# Altium schematic sheet Test.SchDoc
size 400 x 299 mm
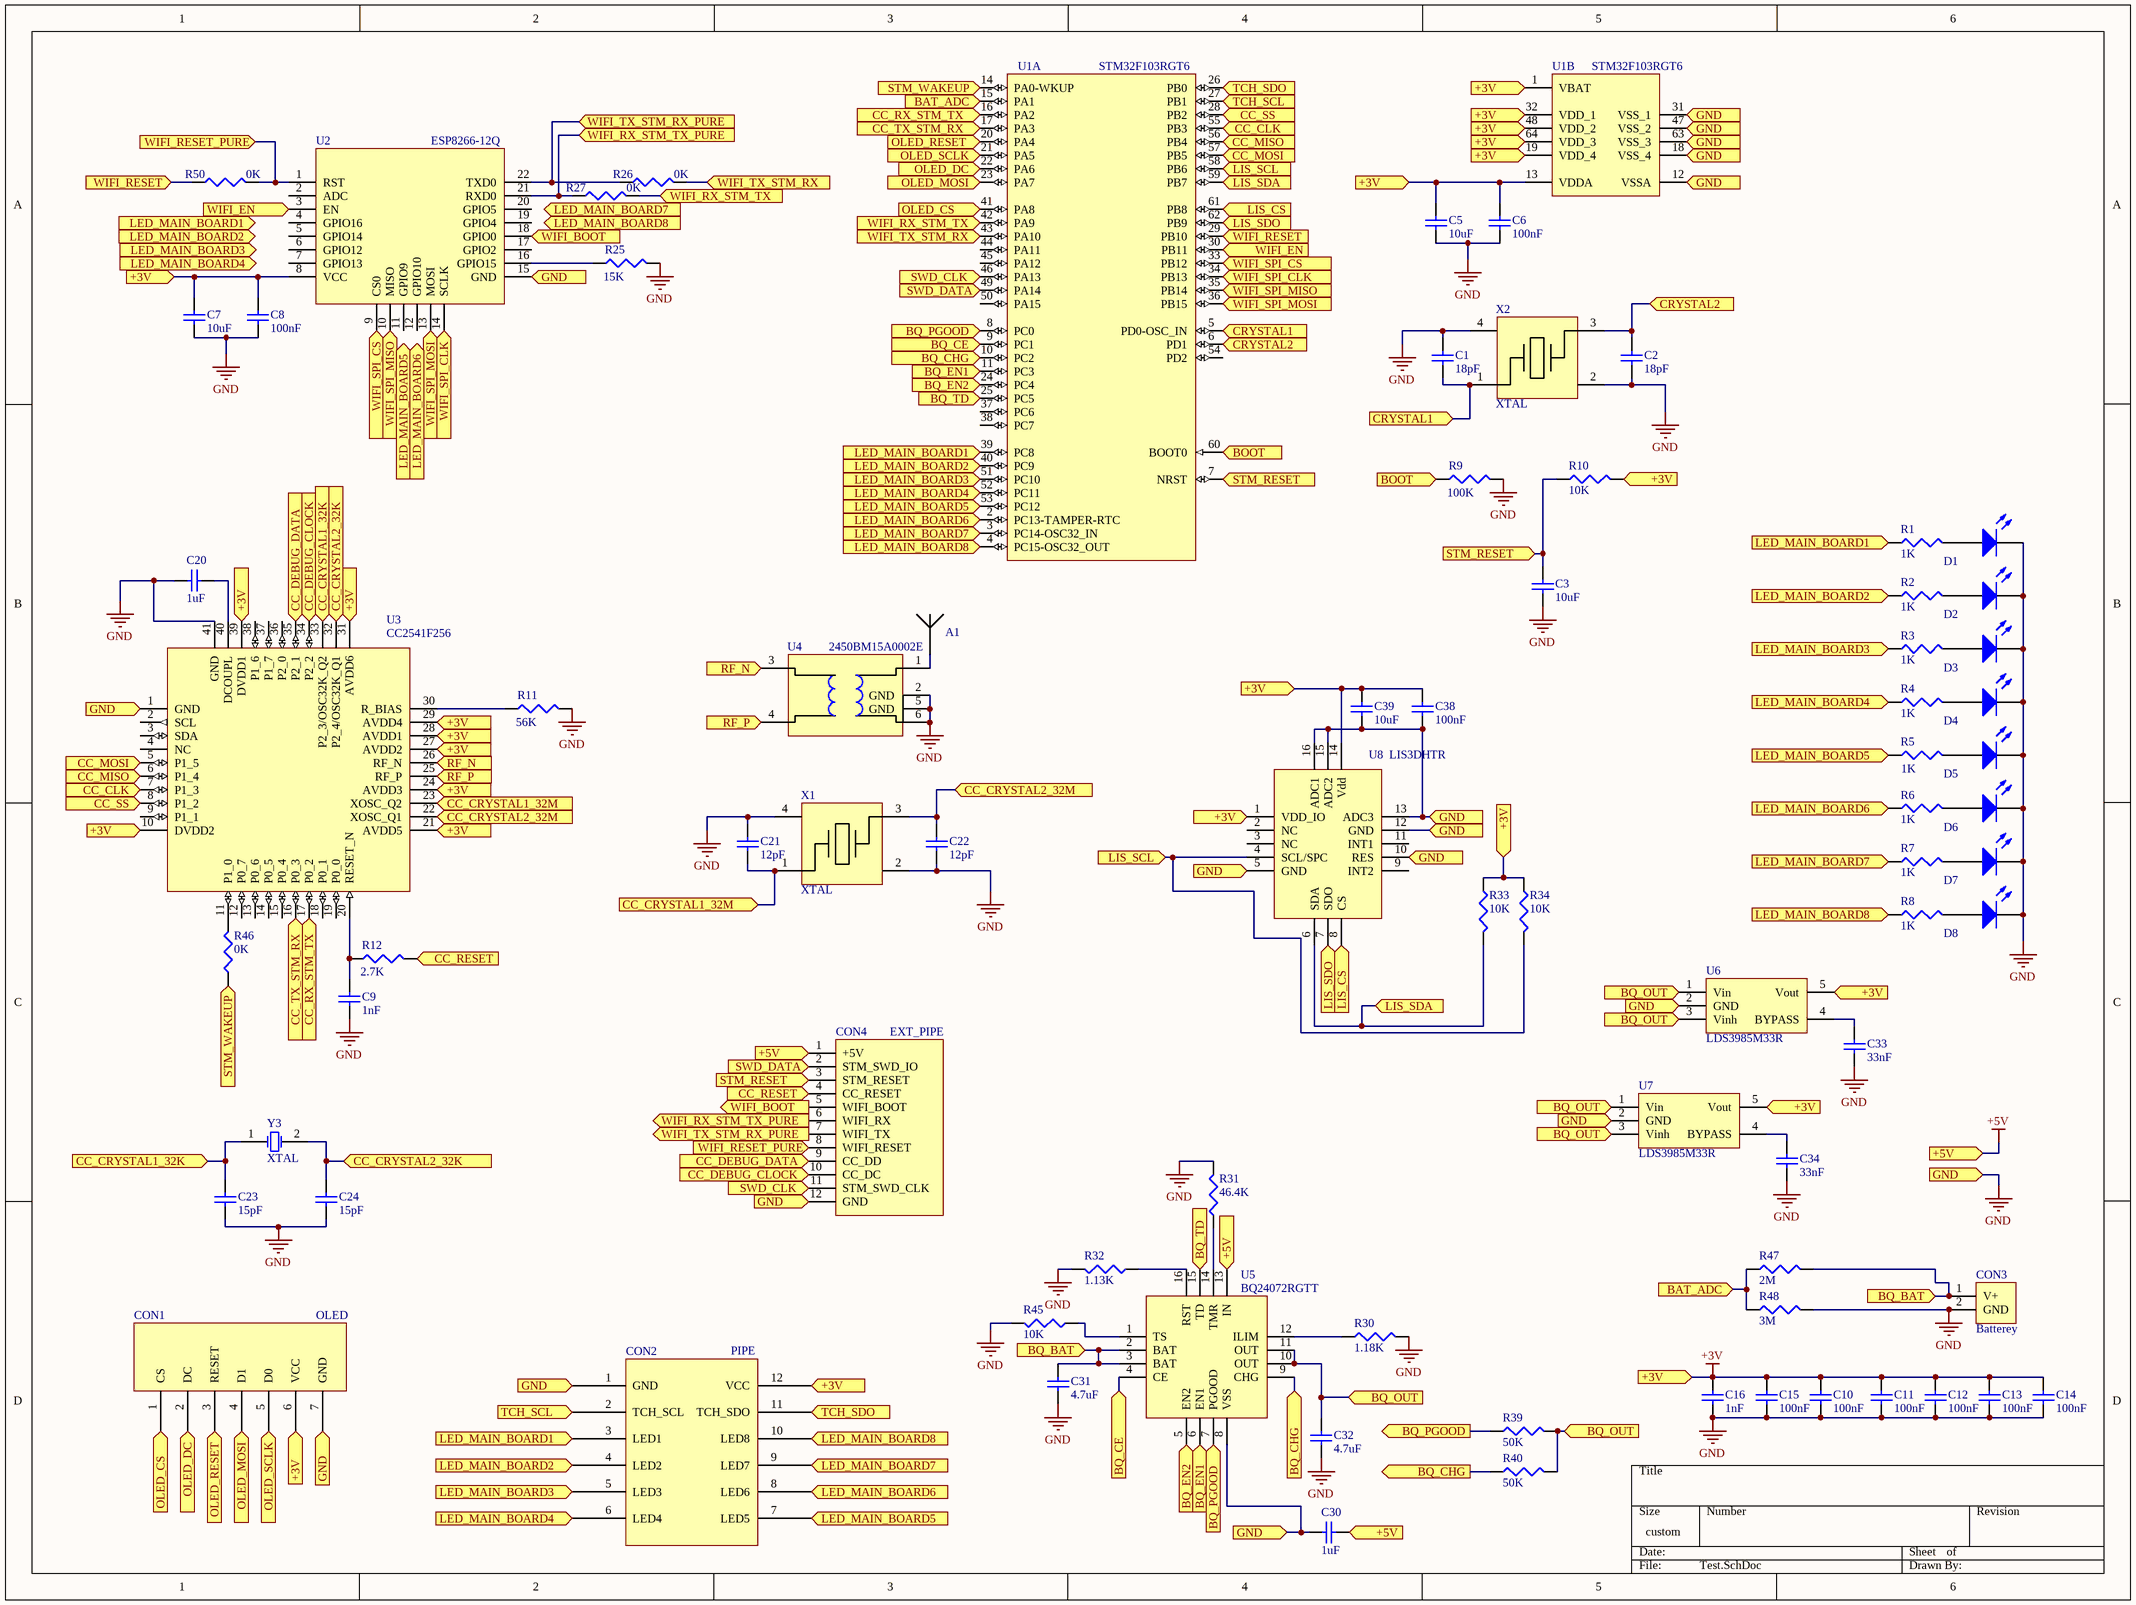
[diagram p0: Test.SchDoc]

## Parts
A1  ANTENNA  [ANTENNA]  (value not drawn)
C1  value 18pF  [1608[0603]]  (hidden comment: Cap Semi)
C2  value 18pF  [1608[0603]]  (hidden comment: Cap Semi)
C3  value 10uF  [1608[0603]]  (hidden comment: Cap Semi)
C5  value 10uF  [CAP_0805]  (hidden comment: Cap Semi)
C6  value 100nF  [1608[0603]]  (hidden comment: Cap Semi)
C7  value 10uF  [CAP_1206]  (hidden comment: Cap Semi)
C8  value 100nF  [1608[0603]]  (hidden comment: Cap Semi)
C9  value 1nF  [1608[0603]]  (hidden comment: Cap Semi)
C10  value 100nF  [1608[0603]]  (hidden comment: Cap Semi)
C11  value 100nF  [1608[0603]]  (hidden comment: Cap Semi)
C12  value 100nF  [1608[0603]]  (hidden comment: Cap Semi)
C13  value 100nF  [1608[0603]]  (hidden comment: Cap Semi)
C14  value 100nF  [1608[0603]]  (hidden comment: Cap Semi)
C15  value 100nF  [1608[0603]]  (hidden comment: Cap Semi)
C16  value 1nF  [1608[0603]]  (hidden comment: Cap Semi)
C20  value 1uF  [CAP_0805]  (hidden comment: Cap Semi)
C21  value 12pF  [1608[0603]]  (hidden comment: Cap Semi)
C22  value 12pF  [1608[0603]]  (hidden comment: Cap Semi)
C23  value 15pF  [1608[0603]]  (hidden comment: Cap Semi)
C24  value 15pF  [1608[0603]]  (hidden comment: Cap Semi)
C30  value 1uF  [CAP_0805]  (hidden comment: Cap Semi)
C31  value 4.7uF  [CAP_1206]  (hidden comment: Cap Semi)
C32  value 4.7uF  [1608[0603]]  (hidden comment: Cap Semi)
C33  value 33nF  [1608[0603]]  (hidden comment: Cap Semi)
C34  value 33nF  [1608[0603]]  (hidden comment: Cap Semi)
C38  value 100nF  [1608[0603]]  (hidden comment: Cap Semi)
C39  value 10uF  [CAP_0805]  (hidden comment: Cap Semi)
CON1  OLED  [OLED_SNMALL]
CON2  PIPE  [PIPE_top_only]
CON3  Batterey  [Batterey]
CON4  EXT_PIPE  [DEBUG_PIPE_TOP_ONLY]
D1  LED2  [LED0603]  (value not drawn)
D2  LED2  [LED0603]  (value not drawn)
D3  LED2  [LED0603]  (value not drawn)
D4  LED2  [LED0603]  (value not drawn)
D5  LED2  [LED0603]  (value not drawn)
D6  LED2  [LED0603]  (value not drawn)
D7  LED2  [LED0603]  (value not drawn)
D8  LED2  [LED0603]  (value not drawn)
R1  value 1K  [RES_0402]  (hidden comment: Res3)
R2  value 1K  [RES_0402]  (hidden comment: Res3)
R3  value 1K  [RES_0402]  (hidden comment: Res3)
R4  value 1K  [RES_0402]  (hidden comment: Res3)
R5  value 1K  [RES_0402]  (hidden comment: Res3)
R6  value 1K  [RES_0402]  (hidden comment: Res3)
R7  value 1K  [RES_0402]  (hidden comment: Res3)
R8  value 1K  [RES_0402]  (hidden comment: Res3)
R9  value 100K  [RES_0402]  (hidden comment: Res3)
R10  value 10K  [RES_0402]  (hidden comment: Res3)
R11  value 56K  [RES_0402]  (hidden comment: Res3)
R12  value 2.7K  [RES_0402]  (hidden comment: Res3)
R25  value 15K  [RES_0402]  (hidden comment: Res3)
R26  value 0K  [RES_0402]  (hidden comment: Res3)
R27  value 0K  [RES_0402]  (hidden comment: Res3)
R30  value 1.18K  [RES_0402]  (hidden comment: Res3)
R31  value 46.4K  [RES_0402]  (hidden comment: Res3)
R32  value 1.13K  [RES_0402]  (hidden comment: Res3)
R33  value 10K  [RES_0402]  (hidden comment: Res3)
R34  value 10K  [RES_0402]  (hidden comment: Res3)
R39  value 50K  [RES_0402]  (hidden comment: Res3)
R40  value 50K  [RES_0402]  (hidden comment: Res3)
R45  value 10K  [RES_0402]  (hidden comment: Res3)
R46  value 0K  [RES_0402]  (hidden comment: Res3)
R47  value 2M  [RES_0402]  (hidden comment: Res3)
R48  value 3M  [RES_0402]  (hidden comment: Res3)
R50  value 0K  [RES_0402]  (hidden comment: Res3)
U1  STM32F103RGT6  [LQFP64_L]  (parts A,B of 2)
U2  ESP8266-12Q  [ESP8266-12Q]
U3  CC2541F256  [RHA40_4P5X4P5]
U4  2450BM15A0002E  [2450BM15A0002E]
U5  BQ24072RGTT  [VQFN16]
U6  LDS3985M33R  [SOT23-5L]
U7  LDS3985M33R  [SOT23-5L]
U8  LIS3DHTR  [LGA16]
X1  XTAL  [XTAL]
X2  XTAL  [XTAL]
Y3  XTAL  [QUARZ32768]

## Ports
+3V, +5V, BAT_ADC, BOOT, BQ_BAT, BQ_CE, BQ_CHG, BQ_EN1, BQ_EN2, BQ_OUT, BQ_PGOOD, BQ_TD, CC_CLK, CC_DEBUG_CLOCK, CC_DEBUG_DATA, CC_MISO, CC_MOSI, CC_RESET, CC_RX_STM_TX, CC_SS, CC_TX_STM_RX, CRYSTAL1, CRYSTAL2, GND, LED_MAIN_BOARD1, LED_MAIN_BOARD2, LED_MAIN_BOARD3, LED_MAIN_BOARD4, LED_MAIN_BOARD5, LED_MAIN_BOARD6, LED_MAIN_BOARD7, LED_MAIN_BOARD8, LIS_CS, LIS_SCL, LIS_SDA, LIS_SDO, OLED_CS, OLED_DC, OLED_MOSI, OLED_RESET, OLED_SCLK, RF_N, RF_P, STM_RESET, STM_WAKEUP, SWD_CLK, SWD_DATA, TCH_SCL, TCH_SDO, WIFI_BOOT, WIFI_EN, WIFI_RESET, WIFI_RESET_PURE, WIFI_RX_STM_TX, WIFI_RX_STM_TX_PURE, WIFI_SPI_CLK, WIFI_SPI_CS, WIFI_SPI_MISO, WIFI_SPI_MOSI, WIFI_TX_STM_RX, WIFI_TX_STM_RX_PURE, СС_CRYSTAL1_32K, СС_CRYSTAL1_32M, СС_CRYSTAL2_32K, СС_CRYSTAL2_32M

## Nets
+3V: C5.2 C6.2 C7.2 C8.2 C10.2 C11.2 C12.2 C13.2 C14.2 C15.2 C16.2 C38.2 C39.2 CON1.6(VCC) CON2.12(VCC) R10.2 R33.1 R34.1 U1.1(VBAT) U1.13(VDDA) U1.19(VDD_4) U1.32(VDD_1) U1.48(VDD_2) U1.64(VDD_3) U2.8(VCC) U3.10(DVDD2) U3.21(AVDD5) U3.24(AVDD3) U3.27(AVDD2) U3.28(AVDD1) U3.29(AVDD4) U3.31(AVDD6) U3.39(DVDD1) U6.5(Vout) U7.5(Vout) U8.1(VDD_IO) U8.14(Vdd) ; port +3V
+5V: C30.1 CON4.1(+5V) U5.13(IN) ; port +5V
GND: C1.2 C2.1 C3.1 C5.1 C6.1 C7.1 C8.1 C9.1 C10.1 C11.1 C12.1 C13.1 C14.1 C15.1 C16.1 C20.1 C21.2 C22.1 C23.1 C24.1 C30.2 C31.1 C32.1 C33.1 C34.1 C38.1 C39.1 CON1.7(GND) CON2.1(GND) CON3.2(GND) CON4.12(GND) D1.2(K) D2.2(K) D3.2(K) D4.2(K) D5.2(K) D6.2(K) D7.2(K) D8.2(K) R9.2 R11.2 R25.2 R30.2 R31.2 R32.2 R45.2 R48.2 U1.12(VSSA) U1.18(VSS_4) U1.31(VSS_1) U1.47(VSS_2) U1.63(VSS_3) U2.15(GND) U3.1(GND) U3.41(GND) U4.2(GND) U4.5(GND) U4.6 U5.8(VSS) U6.2(GND) U7.2(GND) U8.5(GND) U8.10(RES) U8.12(GND) U8.13(ADC3) U8.15(ADC2) U8.16(ADC1) X1.2 X1.4 X2.2 X2.4 ; port GND
BAT_ADC: R47.1 R48.1 U1.15(PA1) ; port BAT_ADC
BOOT: R9.1 U1.60(BOOT0) ; port BOOT
BQ_BAT: C31.2 CON3.1(V+) R47.2 U5.2(BAT) U5.3(BAT) ; port BQ_BAT
BQ_CE: U1.9(PC1) U5.4(CE) ; port BQ_CE
BQ_CHG: R40.1 U1.10(PC2) U5.9(CHG) ; port BQ_CHG
BQ_EN1: U1.11(PC3) U5.6(EN1) ; port BQ_EN1
BQ_EN2: U1.24(PC4) U5.5(EN2) ; port BQ_EN2
BQ_OUT: C32.2 R39.2 R40.2 U5.10(OUT) U5.11(OUT) U6.1(Vin) U6.3(Vinh) U7.1(Vin) U7.3(Vinh) ; port BQ_OUT
BQ_PGOOD: R39.1 U1.8(PC0) U5.7(PGOOD) ; port BQ_PGOOD
BQ_TD: U1.25(PC5) U5.15(TD) ; port BQ_TD
CC_CLK: U1.55(PB3) U3.7(P1_3) ; port CC_CLK
CC_DEBUG_CLOCK: CON4.10(CC_DC) U3.34(P2_2) ; port CC_DEBUG_CLOCK
CC_DEBUG_DATA: CON4.9(CC_DD) U3.35(P2_1) ; port CC_DEBUG_DATA
CC_MISO: U1.56(PB4) U3.6(P1_4) ; port CC_MISO
CC_MOSI: U1.57(PB5) U3.5(P1_5) ; port CC_MOSI
CC_RESET: CON4.4(CC_RESET) R12.2 ; port CC_RESET
CC_RX_STM_TX: U1.16(PA2) U3.17(P0_2) ; port CC_RX_STM_TX
CC_SS: U1.28(PB2) U3.8(P1_2) ; port CC_SS
CC_TX_STM_RX: U1.17(PA3) U3.16(P0_3) ; port CC_TX_STM_RX
CRYSTAL1: C1.1 U1.5(PD0-OSC_IN) X2.1 ; port CRYSTAL1
CRYSTAL2: C2.2 U1.6(PD1) X2.3 ; port CRYSTAL2
LED_MAIN_BOARD1: CON2.3(LED1) R1.1 U1.39(PC8) ; port LED_MAIN_BOARD1
LED_MAIN_BOARD2: CON2.4(LED2) R2.1 U1.40(PC9) ; port LED_MAIN_BOARD2
LED_MAIN_BOARD3: CON2.5(LED3) R3.1 U1.51(PC10) ; port LED_MAIN_BOARD3
LED_MAIN_BOARD4: CON2.6(LED4) R4.1 U1.52(PC11) ; port LED_MAIN_BOARD4
LED_MAIN_BOARD5: CON2.7(LED5) R5.1 U1.53(PC12) ; port LED_MAIN_BOARD5
LED_MAIN_BOARD6: CON2.8(LED6) R6.1 U1.2(PC13-TAMPER-RTC) ; port LED_MAIN_BOARD6
LED_MAIN_BOARD7: CON2.9(LED7) R7.1 U1.3(PC14-OSC32_IN) ; port LED_MAIN_BOARD7
LED_MAIN_BOARD8: CON2.10(LED8) R8.1 U1.4(PC15-OSC32_OUT) ; port LED_MAIN_BOARD8
LIS_CS: U1.61(PB8) U8.8(CS) ; port LIS_CS
LIS_SCL: R34.2 U1.58(PB6) U8.4(SCL/SPC) ; port LIS_SCL
LIS_SDA: R33.2 U1.59(PB7) U8.6(SDA) ; port LIS_SDA
LIS_SDO: U1.62(PB9) U8.7(SDO) ; port LIS_SDO
OLED_CS: CON1.1(CS) U1.41(PA8) ; port OLED_CS
OLED_DC: CON1.2(DC) U1.22(PA6) ; port OLED_DC
OLED_MOSI: CON1.4(D1) U1.23(PA7) ; port OLED_MOSI
OLED_RESET: CON1.3(RESET) U1.20(PA4) ; port OLED_RESET
OLED_SCLK: CON1.5(D0) U1.21(PA5) ; port OLED_SCLK
RF_N: U3.26(RF_N) U4.3 ; port RF_N
RF_P: U3.25(RF_P) U4.4 ; port RF_P
STM_RESET: C3.2 CON4.3(STM_RESET) R10.1 U1.7(NRST) ; port STM_RESET
STM_WAKEUP: R46.1 U1.14(PA0-WKUP) ; port STM_WAKEUP
SWD_CLK: CON4.11(STM_SWD_CLK) U1.46(PA13) ; port SWD_CLK
SWD_DATA: CON4.2(STM_SWD_IO) U1.49(PA14) ; port SWD_DATA
TCH_SCL: CON2.2(TCH_SCL) U1.27(PB1) ; port TCH_SCL
TCH_SDO: CON2.11(TCH_SDO) U1.26(PB0) ; port TCH_SDO
WIFI_BOOT: CON4.5(WIFI_BOOT) U2.18(GPIO0) ; port WIFI_BOOT
WIFI_EN: U1.30(PB11) U2.3(EN) ; port WIFI_EN
WIFI_RESET: R50.1 U1.29(PB10) ; port WIFI_RESET
WIFI_RESET_PURE: CON4.8(WIFI_RESET) R50.2 U2.1(RST) ; port WIFI_RESET_PURE
WIFI_RX_STM_TX: R27.2 U1.42(PA9) ; port WIFI_RX_STM_TX
WIFI_RX_STM_TX_PURE: CON4.6(WIFI_RX) R27.1 U2.21(RXD0) ; port WIFI_RX_STM_TX_PURE
WIFI_SPI_CLK: U1.34(PB13) U2.14(SCLK) ; port WIFI_SPI_CLK
WIFI_SPI_CS: U1.33(PB12) U2.9(CS0) ; port WIFI_SPI_CS
WIFI_SPI_MISO: U1.35(PB14) U2.10(MISO) ; port WIFI_SPI_MISO
WIFI_SPI_MOSI: U1.36(PB15) U2.13(MOSI) ; port WIFI_SPI_MOSI
WIFI_TX_STM_RX: R26.2 U1.43(PA10) ; port WIFI_TX_STM_RX
WIFI_TX_STM_RX_PURE: CON4.7(WIFI_TX) R26.1 U2.22(TXD0) ; port WIFI_TX_STM_RX_PURE
СС_CRYSTAL1_32K: C23.2 U3.33(P2_3/OSC32K_Q2) Y3.1(OSC1) ; port СС_CRYSTAL1_32K
СС_CRYSTAL1_32M: C21.1 U3.23(XOSC_Q2) X1.1 ; port СС_CRYSTAL1_32M
СС_CRYSTAL2_32K: C24.2 U3.32(P2_4/OSC32K_Q1) Y3.2(OSC2) ; port СС_CRYSTAL2_32K
СС_CRYSTAL2_32M: C22.2 U3.22(XOSC_Q1) X1.3 ; port СС_CRYSTAL2_32M
NetA1_1: A1.1 U4.1
NetC9_2: C9.2 R12.1 U3.20(RESET_N)
NetC20_2: C20.2 U3.40(DCOUPL)
NetC33_2: C33.2 U6.4(BYPASS)
NetC34_2: C34.2 U7.4(BYPASS)
NetD1_1: D1.1(A) R1.2
NetD2_1: D2.1(A) R2.2
NetD3_1: D3.1(A) R3.2
NetD4_1: D4.1(A) R4.2
NetD5_1: D5.1(A) R5.2
NetD6_1: D6.1(A) R6.2
NetD7_1: D7.1(A) R7.2
NetD8_1: D8.1(A) R8.2
NetR11_1: R11.1 U3.30(R_BIAS)
NetR25_1: R25.1 U2.16(GPIO15)
NetR30_1: R30.1 U5.12(ILIM)
NetR31_1: R31.1 U5.14(TMR)
NetR32_1: R32.1 U5.16(RST)
NetR45_1: R45.1 U5.1(TS)
NetR46_2: R46.2 U3.11(P1_0)

Not connected (* = marked no-connect by the designer): A1 2; U1 37(PC6) 38(PC7) 44(PA11) 45(PA12) 50(PA15) 54(PD2); U2 2(ADC) 4(GPIO16) 5(GPIO14) 6(GPIO12) 7(GPIO13) 11(GPIO9) 12(GPIO10) 17(GPIO2) 19(GPIO4) 20(GPIO5); U3 2(SCL) 3(SDA) 4(NC) 9(P1_1) 12(P0_7) 13(P0_6) 14(P0_5) 15(P0_4) 18(P0_1) 19(P0_0) 36(P2_0) 37(P1_7) 38(P1_6); U8 2(NC) 3(NC) 9(INT2) 11(INT1)

## Library data of the parts
C1-C3 C5-C16 C20-C24 C30-C34 C38 C39 = Cap Semi: Capacitor (Semiconductor SIM Model); Published: 8-Jun-2000; LatestRevisionDate: 29-May-2009; LatestRevisionNote: IPC-7351 Footprint Added.; PackageReference: C1206; Publisher: Altium Limited; PackageDescription: Chip Capacitor
D1-D8 = LED2: Typical RED, GREEN, YELLOW, AMBER GaAs LED; Published: 8-Jun-2000; LatestRevisionDate: 17-Jul-2002; LatestRevisionNote: Re-released for DXP Platform.; PackageVersion: Feb-2002; PackageReference: 3.2X1.6X1.1; Publisher: Altium Limited; PackageDescription: SM LED; 2 Flat Leads
R1-R12 R25-R27 R30-R34 R39 R40 R45-R48 R50 = Res3: Resistor; Published: 8-Jun-2000; LatestRevisionDate: 29-May-2009; LatestRevisionNote: IPC-7351 Footprint Added.; PackageReference: J1-0603; Publisher: Altium Limited; PackageDescription: Chip Resistor
U1 = STM32F103RGT6: STM32 ARM-based 32-bit MCU Performance Line with 1024 kB Flash, 96 kB Internal RAM, -40 to +85°C Temperature, 64-Pin LQFP, Tray; DatasheetVersion: rev2.0, Nov-2010; PackageVersion: rev13, Apr-2011; PackageReference: LQFP64; PackageDescription: 64-Pin Low-Profile Quad Flat Pack, 10 x 10 mm Body, 0.5 mm Pitch (LQFP64); ComponentLink1Description: Manufacturer URL; ComponentLink1URL: http://www.st.com/; ComponentLink2Description: STM32F103 Datasheet; ComponentLink2URL: http://www.st.com/internet/com/TECHNICAL_RESOURCES/TECHNICAL_LITERATURE/DATASHEET/CD00253742.pdf; ComponentLink3Description: STM32 Family Web Page; ComponentLink3URL: www.st.com/stm32
Y3 = XTAL: Crystal Oscillator; Published: 8-Jun-2000; LatestRevisionDate: 17-Jul-2002; LatestRevisionNote: Re-released for DXP Platform.; PackageReference: R38; Publisher: Altium Limited; PackageDescription: Crystal, Thru-Hole; 2 Leads; Body 3.1 x 8.2 mm (Dia.xH)